# EAGLE design QuadCopterV2 (EAGLE 9.5.2)

## Sheet 1 of 10: Texas EK-TM4C123GXL CONTROLLER BOARD
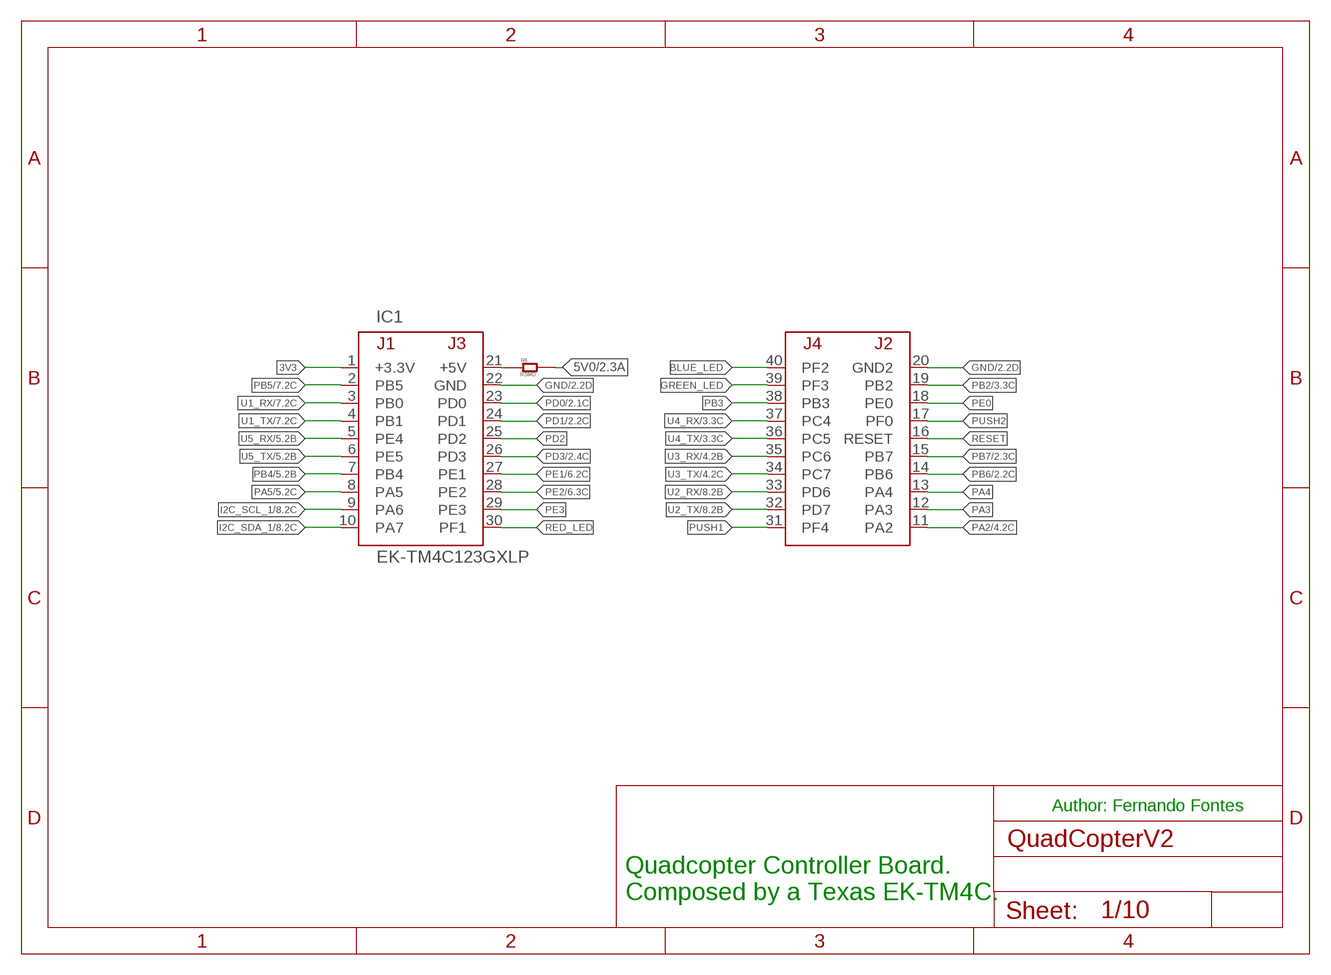
[diagram p0: schematic, sheet 1]

### Parts
IC1  EK-TM4C123GXLP  [TM4C123LAUNCHPAD]
R6  RSMD  [RSMD]

### Nets
3V3: IC1.1(+3.3V)
5V0: R6.2 ; also sheet 2,3,5,6,8,10
BLUE_LED: IC1.40(PF2)
GND: IC1.20(GND2) IC1.22(GND) ; also sheet 2,3,4,5,6,7,8,9,10
GREEN_LED: IC1.39(PF3)
I2C_SCL_1: IC1.9(PA6) ; also sheet 8,9,10
I2C_SDA_1: IC1.10(PA7) ; also sheet 8,9,10
N$1: IC1.21(+5V) R6.1
PA2: IC1.11(PA2) ; also sheet 4
PA3: IC1.12(PA3)
PA4: IC1.13(PA4)
PA5: IC1.8(PA5) ; also sheet 5
PB2: IC1.19(PB2) ; also sheet 3
PB3: IC1.38(PB3)
PB4: IC1.7(PB4) ; also sheet 5
PB5: IC1.2(PB5) ; also sheet 7
PB6: IC1.14(PB6) ; also sheet 2
PB7: IC1.15(PB7) ; also sheet 2
PD0: IC1.23(PD0) ; also sheet 2
PD1: IC1.24(PD1) ; also sheet 2
PD2: IC1.25(PD2)
PD3: IC1.26(PD3) ; also sheet 2
PE0: IC1.18(PE0)
PE1: IC1.27(PE1) ; also sheet 6
PE2: IC1.28(PE2) ; also sheet 6
PE3: IC1.29(PE3)
PUSH1: IC1.31(PF4)
PUSH2: IC1.17(PF0)
RED_LED: IC1.30(PF1)
RESET: IC1.16(RESET)
U1_RX: IC1.3(PB0) ; also sheet 7
U1_TX: IC1.4(PB1) ; also sheet 7
U2_RX: IC1.33(PD6) ; also sheet 8
U2_TX: IC1.32(PD7) ; also sheet 8
U3_RX: IC1.35(PC6) ; also sheet 4
U3_TX: IC1.34(PC7) ; also sheet 4
U4_RX: IC1.37(PC4) ; also sheet 3
U4_TX: IC1.36(PC5) ; also sheet 3
U5_RX: IC1.5(PE4) ; also sheet 5
U5_TX: IC1.6(PE5) ; also sheet 5

### Notes on the sheet
- Author: Fernando Fontes
- Quadcopter Controller Board.
  Composed by a Texas EK-TM4C.

## Sheet 2 of 10: POWER/ESC BOARD
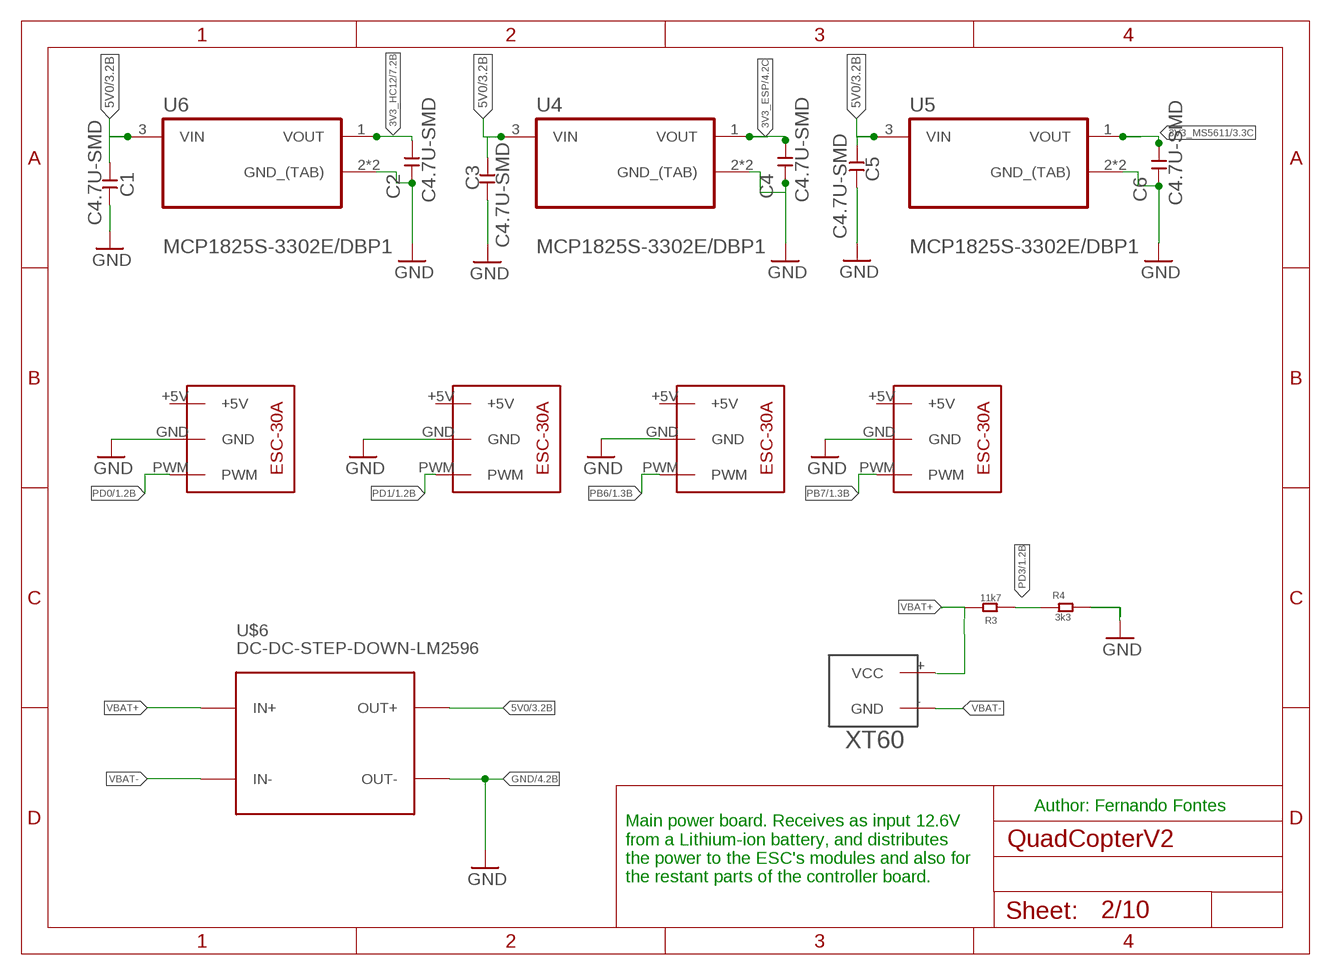
[diagram p1: schematic, sheet 2]

### Parts
C1  C4.7U-SMD  [C4.7U-SMD]
C2  C4.7U-SMD  [C4.7U-SMD]
C3  C4.7U-SMD  [C4.7U-SMD]
C4  C4.7U-SMD  [C4.7U-SMD]
C5  C4.7U-SMD  [C4.7U-SMD]
C6  C4.7U-SMD  [C4.7U-SMD]
R3  11k7  RSMD  [RSMD]
R4  3k3  RSMD  [RSMD]
U4  MCP1825S-3302E/DBP1  [SOT230P700X180-4N#P1]
U5  MCP1825S-3302E/DBP1  [SOT230P700X180-4N#P1]
U6  MCP1825S-3302E/DBP1  [SOT230P700X180-4N#P1]
U7  ESC-30AMS5611  [ESC-30A]
U8  ESC-30AMS5611  [ESC-30A]
U9  ESC-30AMS5611  [ESC-30A]
U10  ESC-30AMS5611  [ESC-30A]
U$6  DC-DC-STEP-DOWN-LM2596  [DC-DC-STEP-DOWN-LM2596]
U$7  XT60  [XT60]

### Nets
3V3_ESP: C4.2 U4.1(VOUT) ; also sheet 4
3V3_HC12: C2.2 U6.1(VOUT) ; also sheet 7
3V3_MS5611: C6.2 U5.1(VOUT) ; also sheet 3,9
5V0: C1.1 C3.2 C5.1 U4.3(VIN) U5.3(VIN) U6.3(VIN) U$6.OUT+ ; also sheet 1,3,5,6,8,10
GND: C1.2 C2.1 C3.1 C4.1 C5.2 C6.1 R4.2 U4.2(GND_(TAB)) U4.4(GND_(TAB)) U5.2(GND_(TAB)) U5.4(GND_(TAB)) U6.2(GND_(TAB)) U6.4(GND_(TAB)) U7.GND U8.GND U9.GND U10.GND U$6.OUT- ; also sheet 1,3,4,5,6,7,8,9,10
PB6: U9.PWM ; also sheet 1
PB7: U10.PWM ; also sheet 1
PD0: U7.PWM ; also sheet 1
PD1: U8.PWM ; also sheet 1
PD3: R3.1 R4.1 ; also sheet 1
VBAT+: R3.2 U$6.IN+ U$7.+(VCC)
VBAT-: U$6.IN- U$7.-(GND)
Unconnected: U7.+5V U8.+5V U9.+5V U10.+5V

### Notes on the sheet
- Author: Fernando Fontes
- Main power board. Receives as input 12.6V
  from a Lithium-ion battery, and distributes
  the power to the ESC's modules and also for
  the restant parts of the controller board.

## Sheet 3 of 10: SIM800L GSM/GPRE MODULE
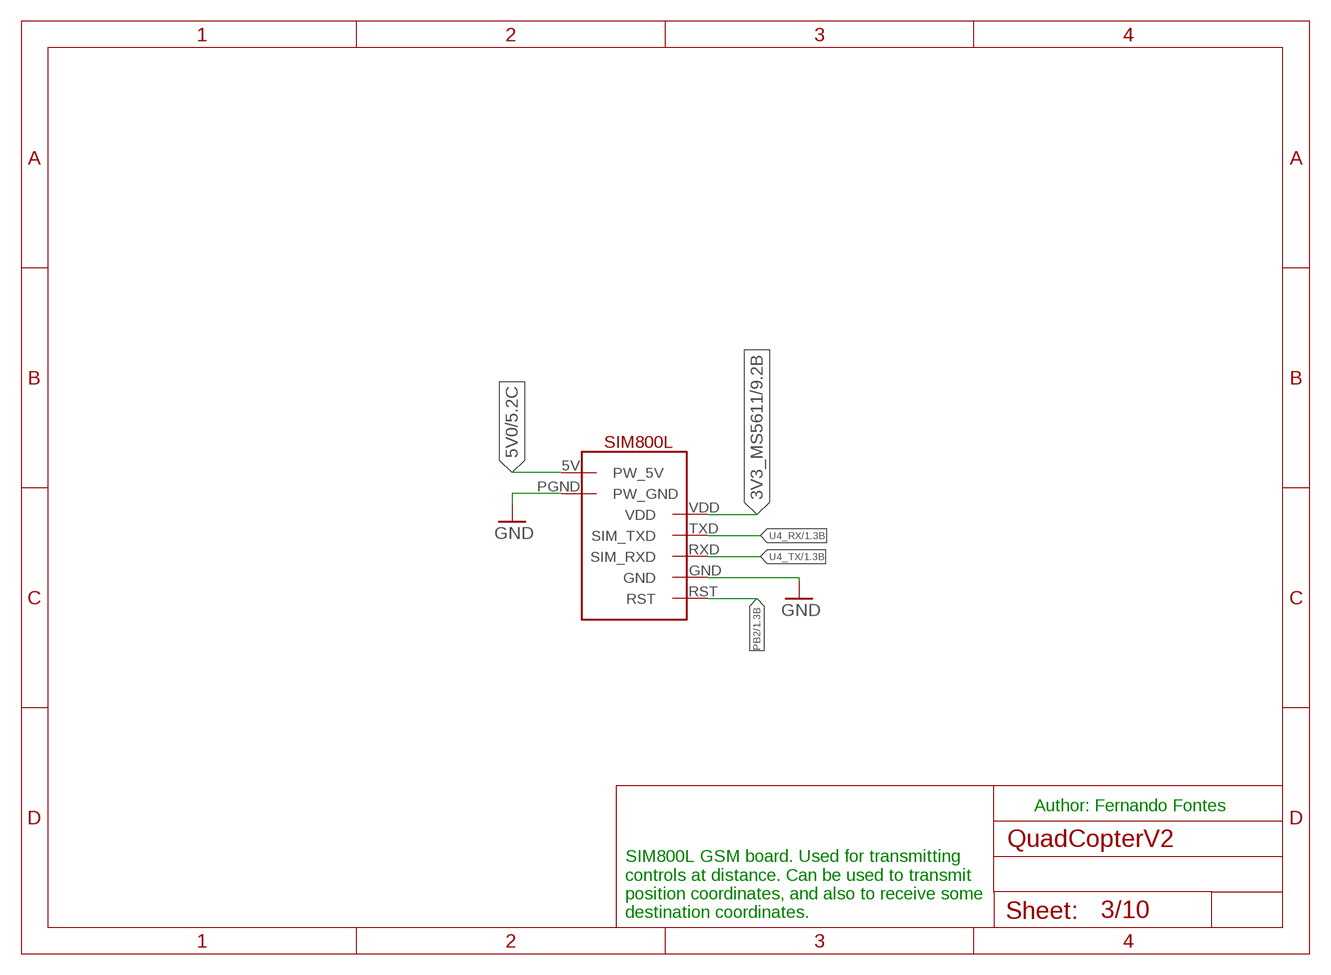
[diagram p2: schematic, sheet 3]

### Parts
U$1  SIM800L  [SIP]

### Nets
3V3_MS5611: U$1.VDD ; also sheet 2,9
5V0: U$1.5V(PW_5V) ; also sheet 1,2,5,6,8,10
GND: U$1.GND U$1.PGND(PW_GND) ; also sheet 1,2,4,5,6,7,8,9,10
PB2: U$1.RST ; also sheet 1
U4_RX: U$1.TXD(SIM_TXD) ; also sheet 1
U4_TX: U$1.RXD(SIM_RXD) ; also sheet 1

### Notes on the sheet
- Author: Fernando Fontes
- SIM800L GSM board. Used for transmitting 
  controls at distance. Can be used to transmit
  position coordinates, and also to receive some
  destination coordinates.

## Sheet 4 of 10: ESP-01 WIFI BOARD
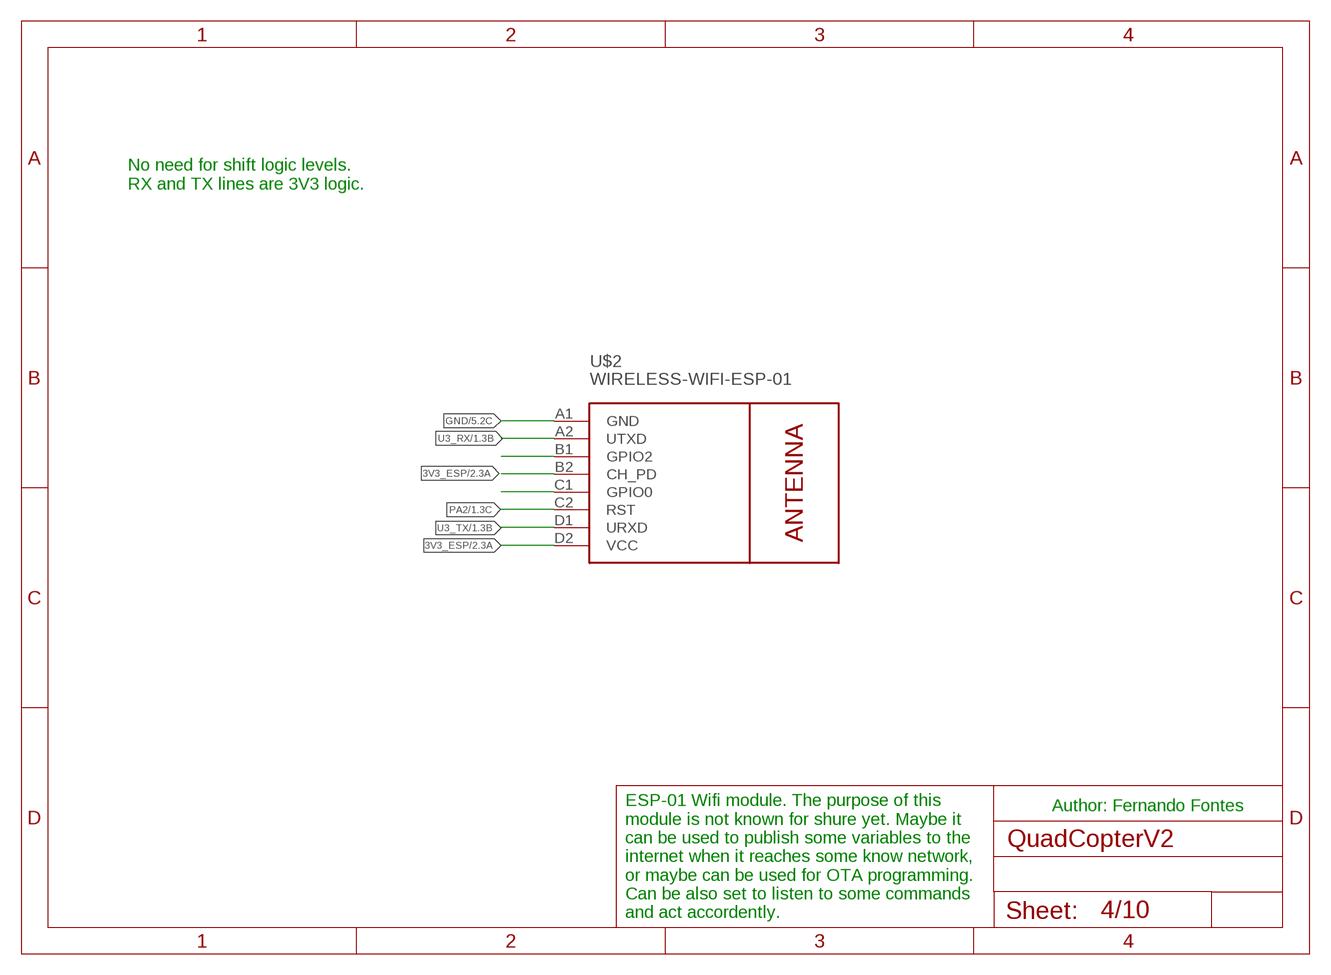
[diagram p3: schematic, sheet 4]

### Parts
U$2  WIRELESS-WIFI-ESP-01  [WIRELESS-WIFI-ESP-01]

### Nets
3V3_ESP: U$2.B2(CH_PD) U$2.D2(VCC) ; also sheet 2
GND: U$2.A1(GND) ; also sheet 1,2,3,5,6,7,8,9,10
N$20: U$2.B1(GPIO2)
N$22: U$2.C1(GPIO0)
PA2: U$2.C2(RST) ; also sheet 1
U3_RX: U$2.A2(UTXD) ; also sheet 1
U3_TX: U$2.D1(URXD) ; also sheet 1

### Notes on the sheet
- No need for shift logic levels. 
  RX and TX lines are 3V3 logic.
- Author: Fernando Fontes
- ESP-01 Wifi module. The purpose of this
  module is not known for shure yet. Maybe it
  can be used to publish some variables to the
  internet when it reaches some know network,
  or maybe can be used for OTA programming.
  Can be also set to listen to some commands
  and act accordently.

## Sheet 5 of 10: HC-05 BLUETOOTH MODULE
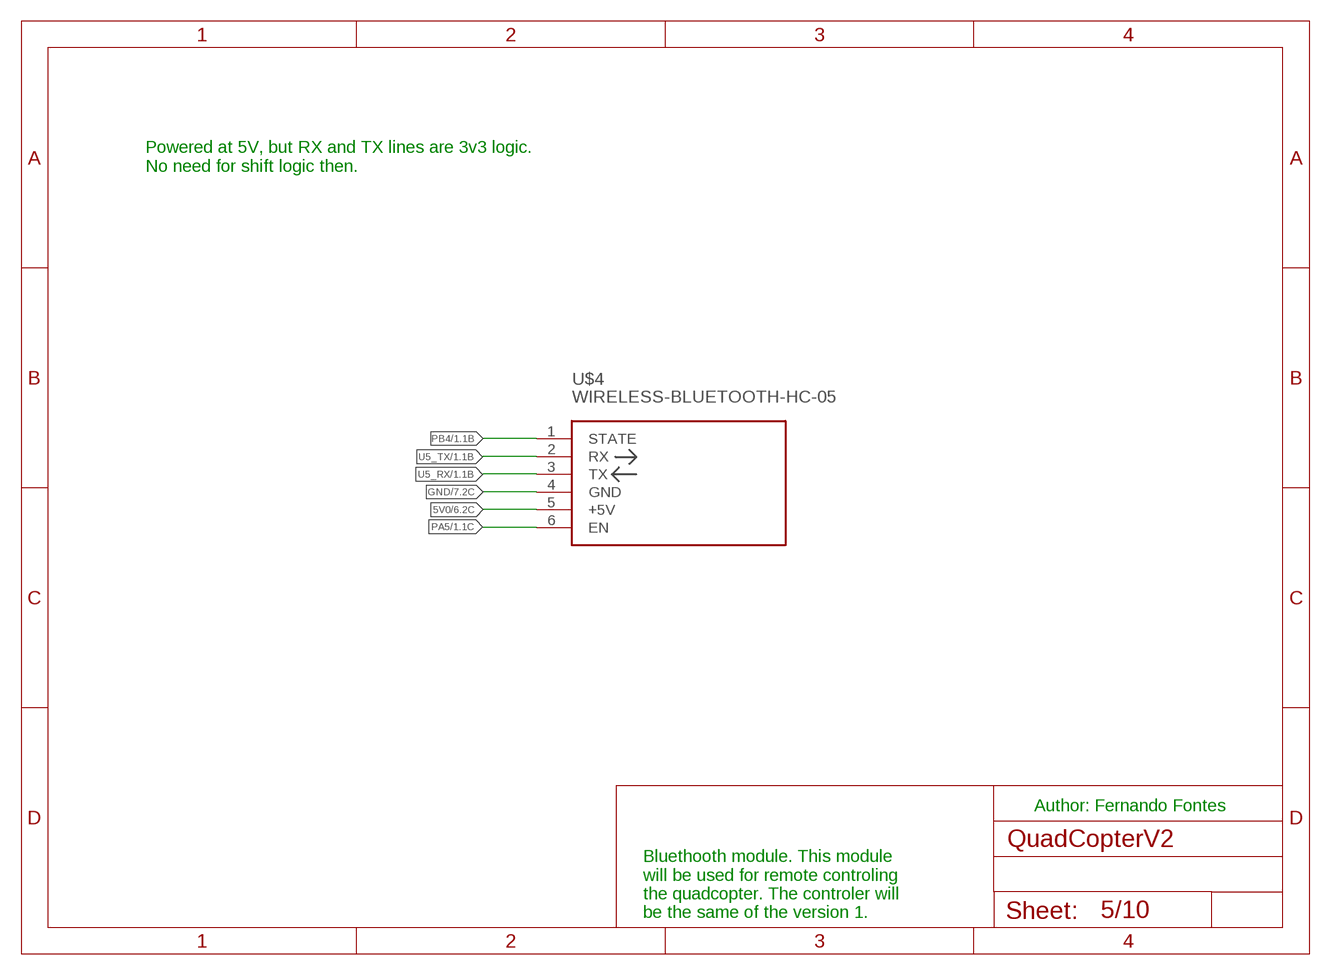
[diagram p4: schematic, sheet 5]

### Parts
U$4  WIRELESS-BLUETOOTH-HC-05  [WIRELESS-BLUETOOTH-HC-05]

### Nets
5V0: U$4.5(+5V) ; also sheet 1,2,3,6,8,10
GND: U$4.4(GND) ; also sheet 1,2,3,4,6,7,8,9,10
PA5: U$4.6(EN) ; also sheet 1
PB4: U$4.1(STATE) ; also sheet 1
U5_RX: U$4.3(TX) ; also sheet 1
U5_TX: U$4.2(RX) ; also sheet 1

### Notes on the sheet
- Powered at 5V, but RX and TX lines are 3v3 logic.
  No need for shift logic then.
- Author: Fernando Fontes
- Bluethooth module. This module
  will be used for remote controling
  the quadcopter. The controler will
  be the same of the version 1.

## Sheet 6 of 10: HC-SR04 ULTRA-SOUND MODULE
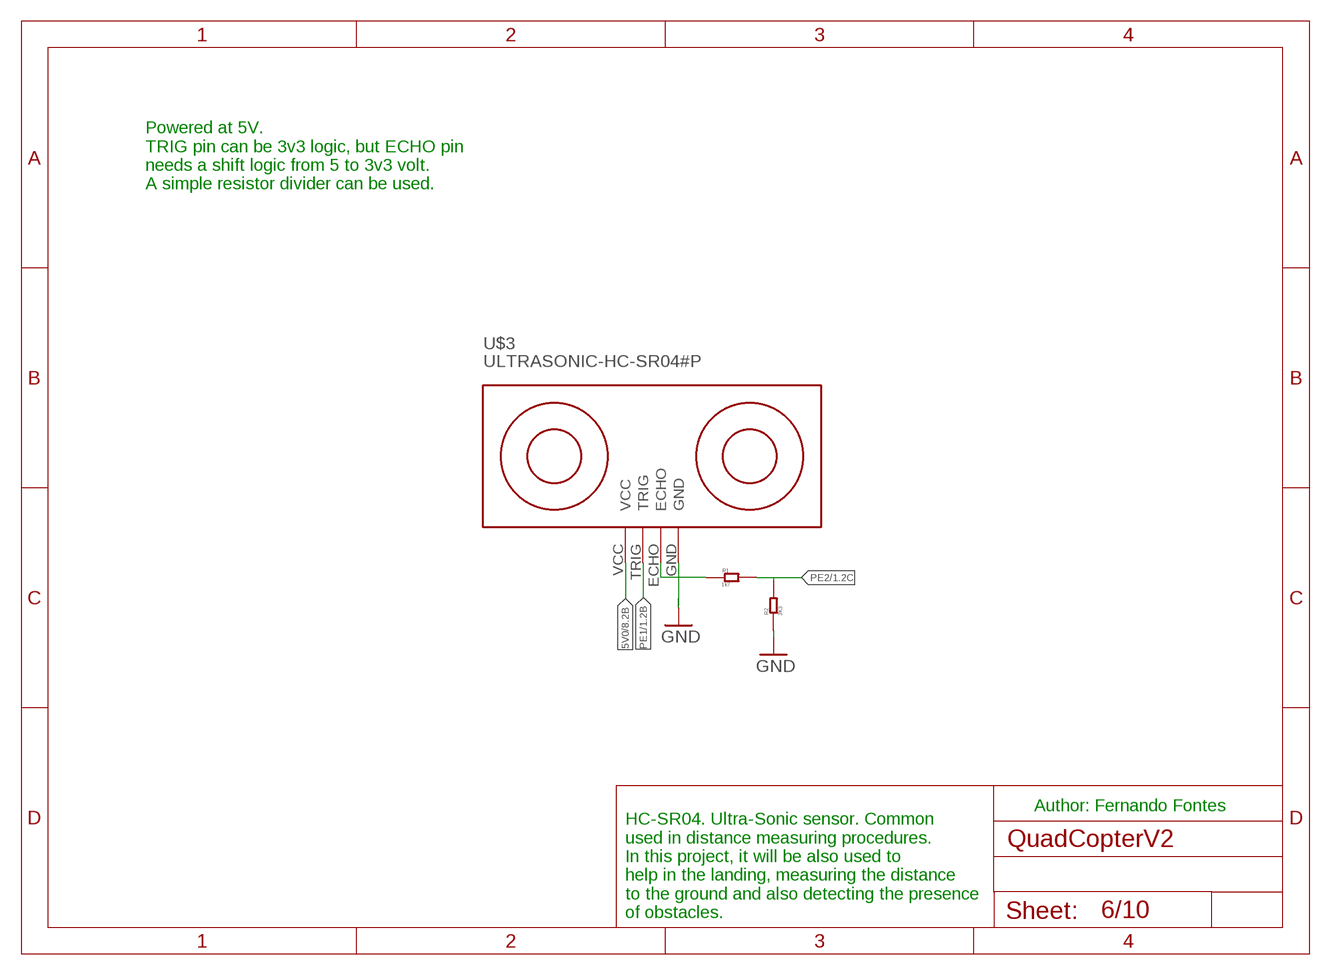
[diagram p5: schematic, sheet 6]

### Parts
R1  1k7  RSMD  [RSMD]
R2  3K3  RSMD  [RSMD]
U$3  ULTRASONIC-HC-SR04#P  [ULTRASONIC-HC-SR04#P]

### Nets
5V0: U$3.VCC ; also sheet 1,2,3,5,8,10
GND: R2.1 U$3.GND ; also sheet 1,2,3,4,5,7,8,9,10
N$34: R1.1 U$3.ECHO
PE1: U$3.TRIG ; also sheet 1
PE2: R1.2 R2.2 ; also sheet 1

### Notes on the sheet
- Powered at 5V.
  TRIG pin can be 3v3 logic, but ECHO pin 
  needs a shift logic from 5 to 3v3 volt.
  A simple resistor divider can be used.
- Author: Fernando Fontes
- HC-SR04. Ultra-Sonic sensor. Common
  used in distance measuring procedures.
  In this project, it will be also used to 
  help in the landing, measuring the distance
  to the ground and also detecting the presence
  of obstacles.

## Sheet 7 of 10: HC-12 RF MODULE
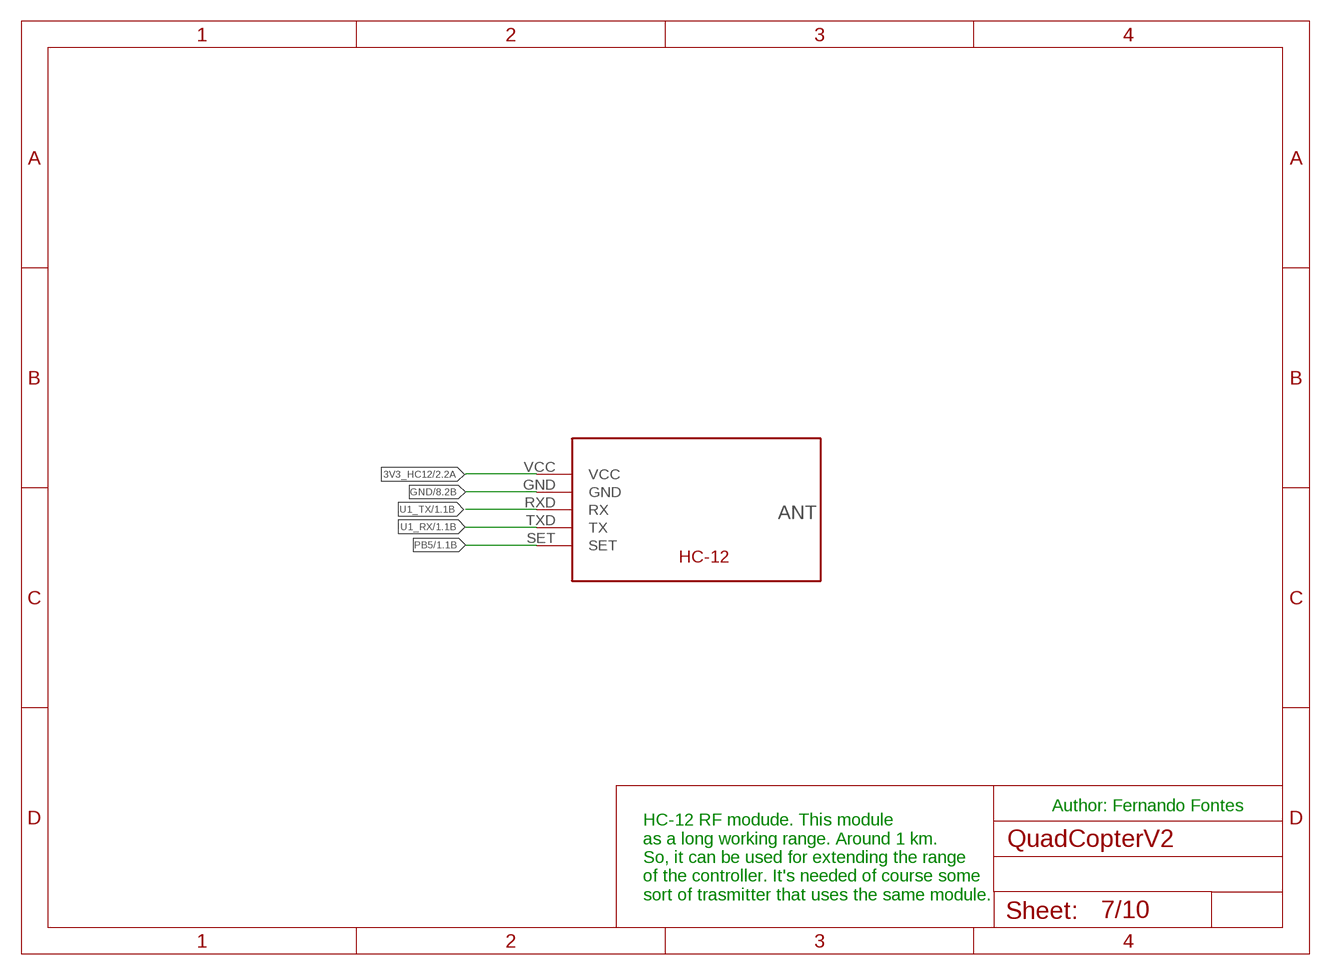
[diagram p6: schematic, sheet 7]

### Parts
U$5  HC-12_FOOTPRINT  [HC-12_FOOTPRINT]

### Nets
3V3_HC12: U$5.VCC ; also sheet 2
GND: U$5.GND ; also sheet 1,2,3,4,5,6,8,9,10
PB5: U$5.SET ; also sheet 1
U1_RX: U$5.TXD(TX) ; also sheet 1
U1_TX: U$5.RXD(RX) ; also sheet 1

### Notes on the sheet
- ANT
- Author: Fernando Fontes
- HC-12 RF modude. This module
  as a long working range. Around 1 km.
  So, it can be used for extending the range
  of the controller. It's needed of course some
  sort of trasmitter that uses the same module.

## Sheet 8 of 10: GPS MODULE
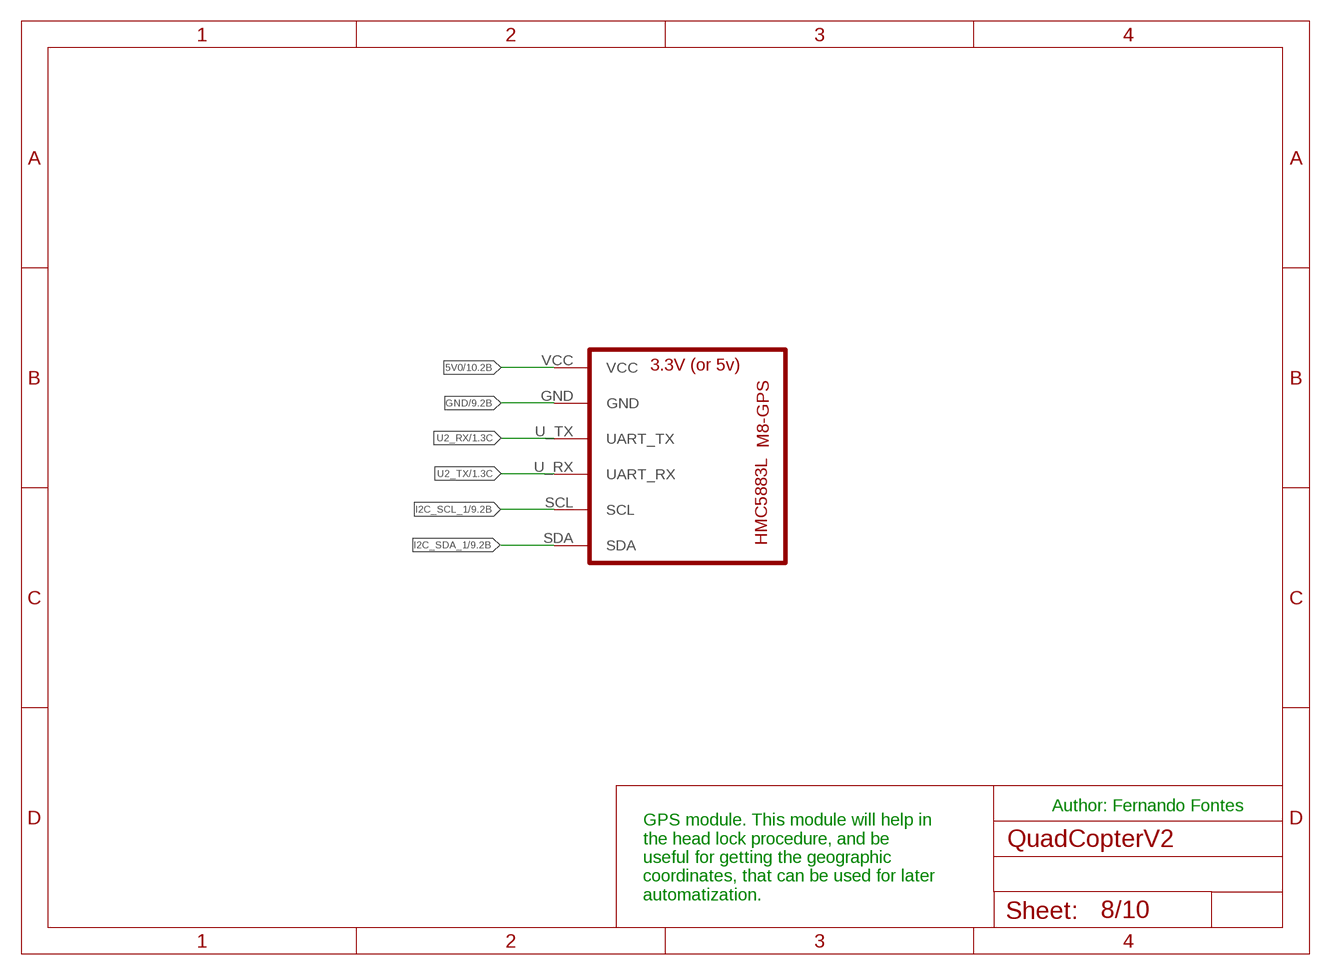
[diagram p7: schematic, sheet 8]

### Parts
U3  GY-63MS5611  [U-BLOX]

### Nets
5V0: U3.VCC ; also sheet 1,2,3,5,6,10
GND: U3.GND ; also sheet 1,2,3,4,5,6,7,9,10
I2C_SCL_1: U3.SCL ; also sheet 1,9,10
I2C_SDA_1: U3.SDA ; also sheet 1,9,10
U2_RX: U3.U_TX(UART_TX) ; also sheet 1
U2_TX: U3.U_RX(UART_RX) ; also sheet 1

### Notes on the sheet
- Author: Fernando Fontes
- GPS module. This module will help in
  the head lock procedure, and be 
  useful for getting the geographic 
  coordinates, that can be used for later
  automatization.

## Sheet 9 of 10: MS5611 BAROMETER BOARD
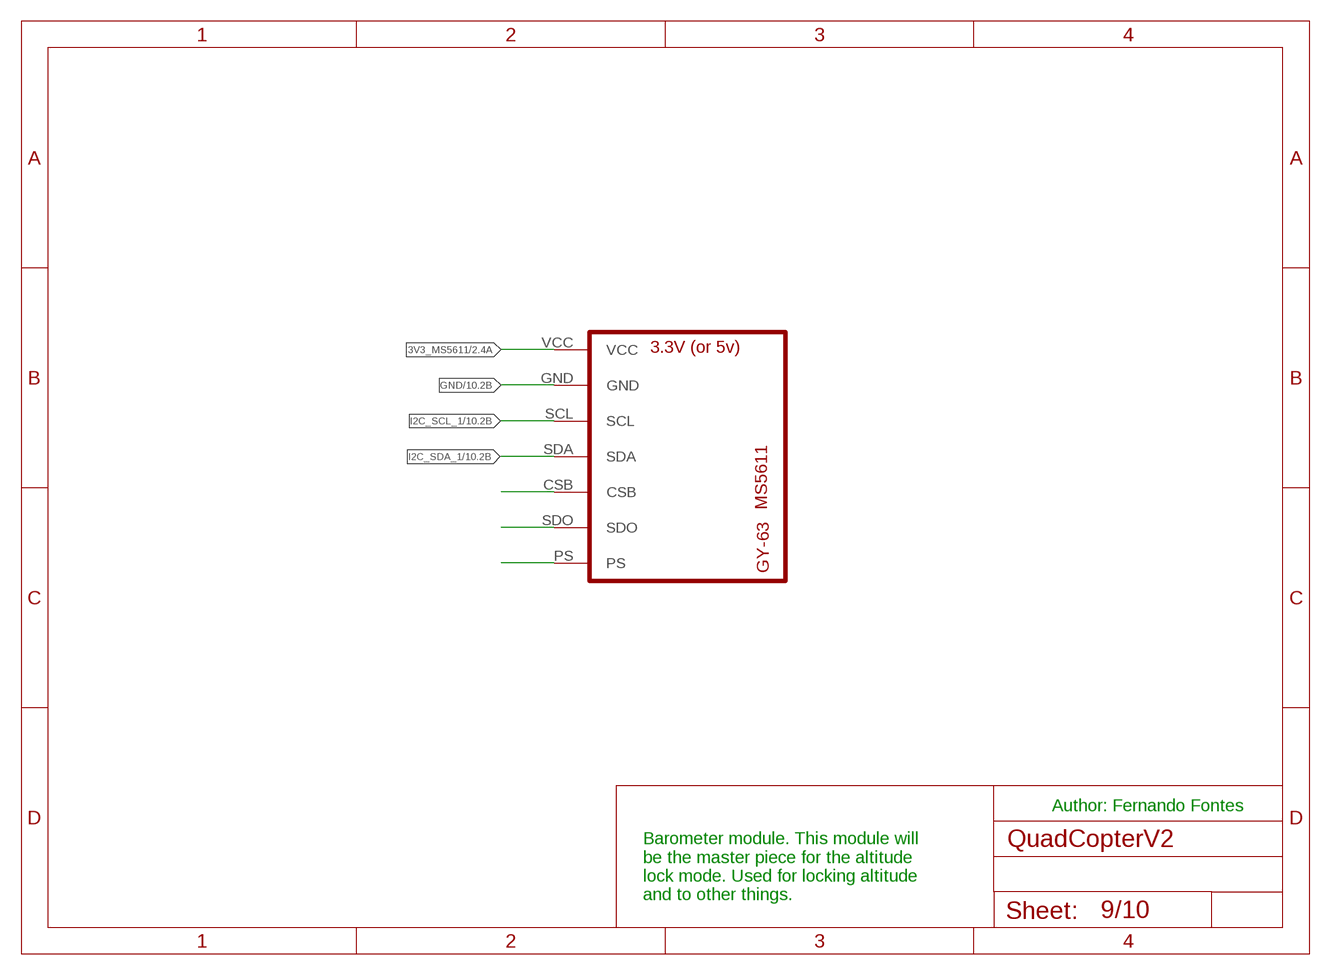
[diagram p8: schematic, sheet 9]

### Parts
U1  GY-63MS5611  [GY-63]

### Nets
3V3_MS5611: U1.VCC ; also sheet 2,3
GND: U1.GND ; also sheet 1,2,3,4,5,6,7,8,10
I2C_SCL_1: U1.SCL ; also sheet 1,8,10
I2C_SDA_1: U1.SDA ; also sheet 1,8,10
N$40: U1.CSB
N$41: U1.SDO
N$42: U1.PS

### Notes on the sheet
- Author: Fernando Fontes
- Barometer module. This module will
  be the master piece for the altitude
  lock mode. Used for locking altitude 
  and to other things.

## Sheet 10 of 10: GY-521 GYROSCOPE MODULE
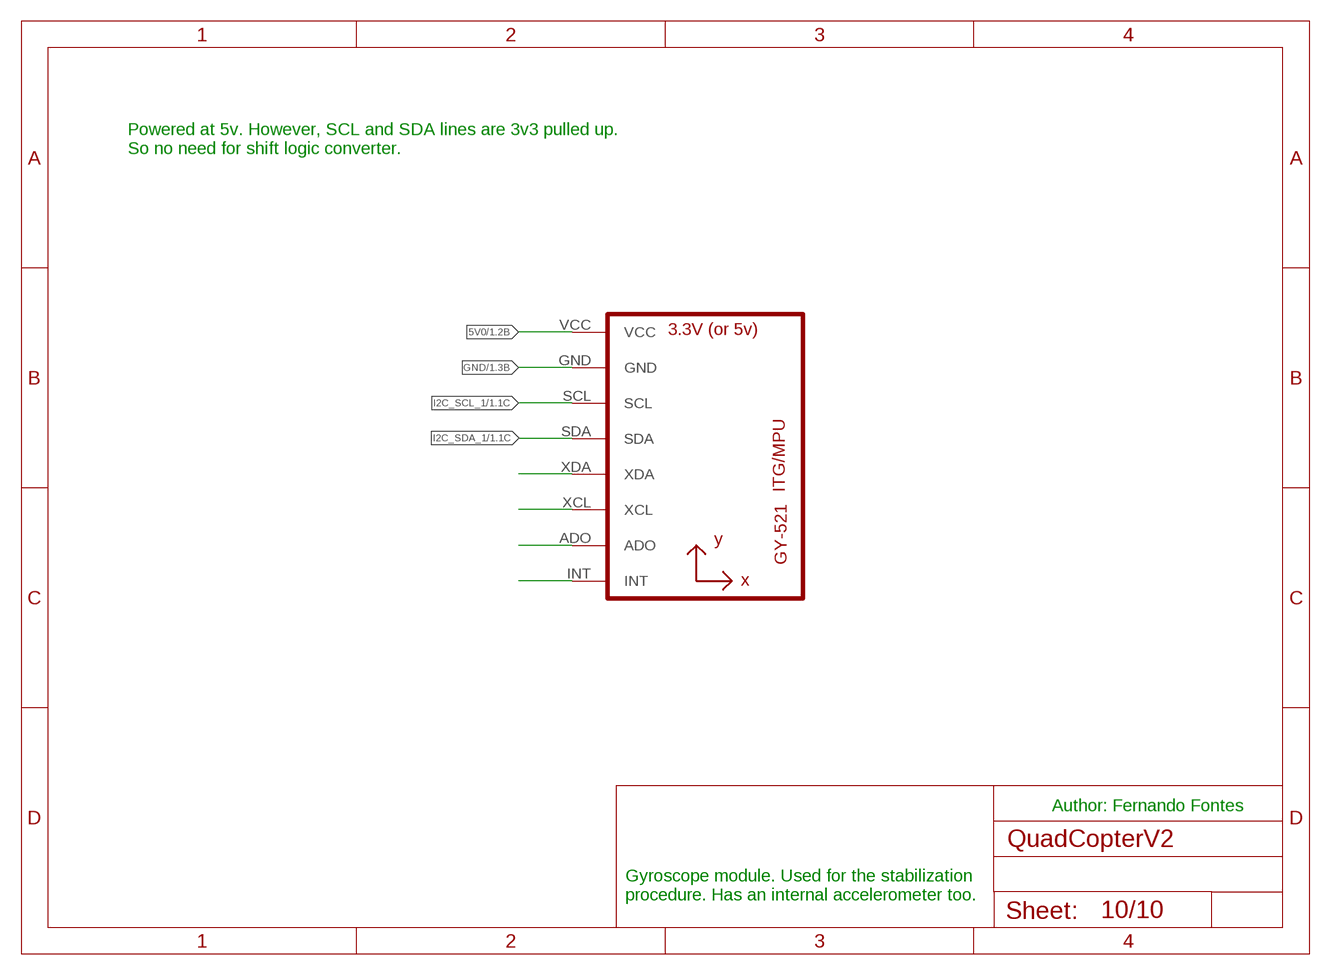
[diagram p9: schematic, sheet 10]

### Parts
U2  GY-521MPU6050  [GY-521]

### Nets
5V0: U2.VCC ; also sheet 1,2,3,5,6,8
GND: U2.GND ; also sheet 1,2,3,4,5,6,7,8,9
I2C_SCL_1: U2.SCL ; also sheet 1,8,9
I2C_SDA_1: U2.SDA ; also sheet 1,8,9
N$45: U2.XDA
N$46: U2.XCL
N$47: U2.ADO
N$48: U2.INT

### Notes on the sheet
- Powered at 5v. However, SCL and SDA lines are 3v3 pulled up. 
  So no need for shift logic converter.
- Author: Fernando Fontes
- Gyroscope module. Used for the stabilization
  procedure. Has an internal accelerometer too.

## Library data of the parts
C1-C6 = smd-rlc:C4.7U-SMD
IC1 = EK-TM4C123GXL:EK-TM4C123GXL: Texas Instruments TM4C123 LaunchPad EK-TM4C123GXL www.ti.com/tool/ek-tm4c123gxl; AVAILABILITY: Unavailable; DESCRIPTION: TM4C123G LaunchPad™ Tiva™ C ARM® Cortex®-M4F MCU 32-Bit Embedded Evaluation Board; MF: Texas Instruments; MP: EK-TM4C123GXL; PACKAGE: None; PRICE: None
R1-R4 R6 = smd-rlc:RSMD; AVAILABILITY: Unavailable; COMMENT: 4-1614884-8; DESCRIPTION: Surface Mount Thin Film Resistor, Cpf Series, 220 Ohm, 100 Mw, - 0.1%, 200 V; MF: TE Connectivity Passive Product; MP: CPF0805B220RE1; PACKAGE: 2012 Stackpole; PRICE: None; TE_PURCHASE_URL: https://www.te.com/usa-en/product-4-1614884-8.html?te_bu=Cor&te_type=disp&te_campaign=seda_glo_cor-seda-global-disp-prtnr-fy19-seda-model-bom-cta_sma-317_1&elqCampaignId=32493
U1 = gy-63:GY-63
U2 = gy-521:GY-521
U3 = u_block_M8:GY-63
U4-U6 = MCP1825S-3302E_DB:MCP1825S-3302E/DB
U7-U10 = ESC-HW30A:ESC-30A
U$1 = SIM800L:SIM800L: SIM800L Blue EVB Board with Level Translation and diode dropper.
U$2 = diy-modules:WIRELESS-WIFI-ESP-01: Wireless Wi-Fi ESP-01 Module based on ESP8266 chip Click here to find device on ebay.com <http://www.ebay.com/sch/esp8266+esp+01+transceiver>
U$3 = diy-modules:ULTRASONIC-HC-SR04: Ultrasonic Ranging Module HC-SR04 More details available here: http://randomnerdtutorials.com/complete-guide-for-ultrasonic-sensor-hc-sr04/ Click here to find device on ebay.com <http://www.ebay.com/sch/hc+sr04+ultrasonic>
U$4 = diy-modules:WIRELESS-BLUETOOTH-HC-05: Bluetooth Transceiver Module based on HC-05 board Tutorial is available here: https://arduino-info.wikispaces.com/BlueTooth-HC05-HC06-Modules-How-To Click here to find device on ebay.com <http://www.ebay.com/sch/hc-05+module+rs232>
U$5 = hc12_433mhz:HC-12_FOOTPRINT: HC-12 433MHz module footprint MCHFIX is for mechanical fix pin which is NC but on this file connected to GND https://github.com/meendiz/hc-12_si4463/
U$6 = diy-modules:DC-DC-STEP-DOWN-LM2596: DC/DC Step-Down Regulator based on LM2596-ADJ chip LM2596 datasheet available here: http://www.ti.com/lit/ds/symlink/lm2596.pdf Click here to find device on ebay.com <http://www.ebay.com/sch/lm2596+power+regulator>
U$7 = XT60:XT60: XT60

## Board
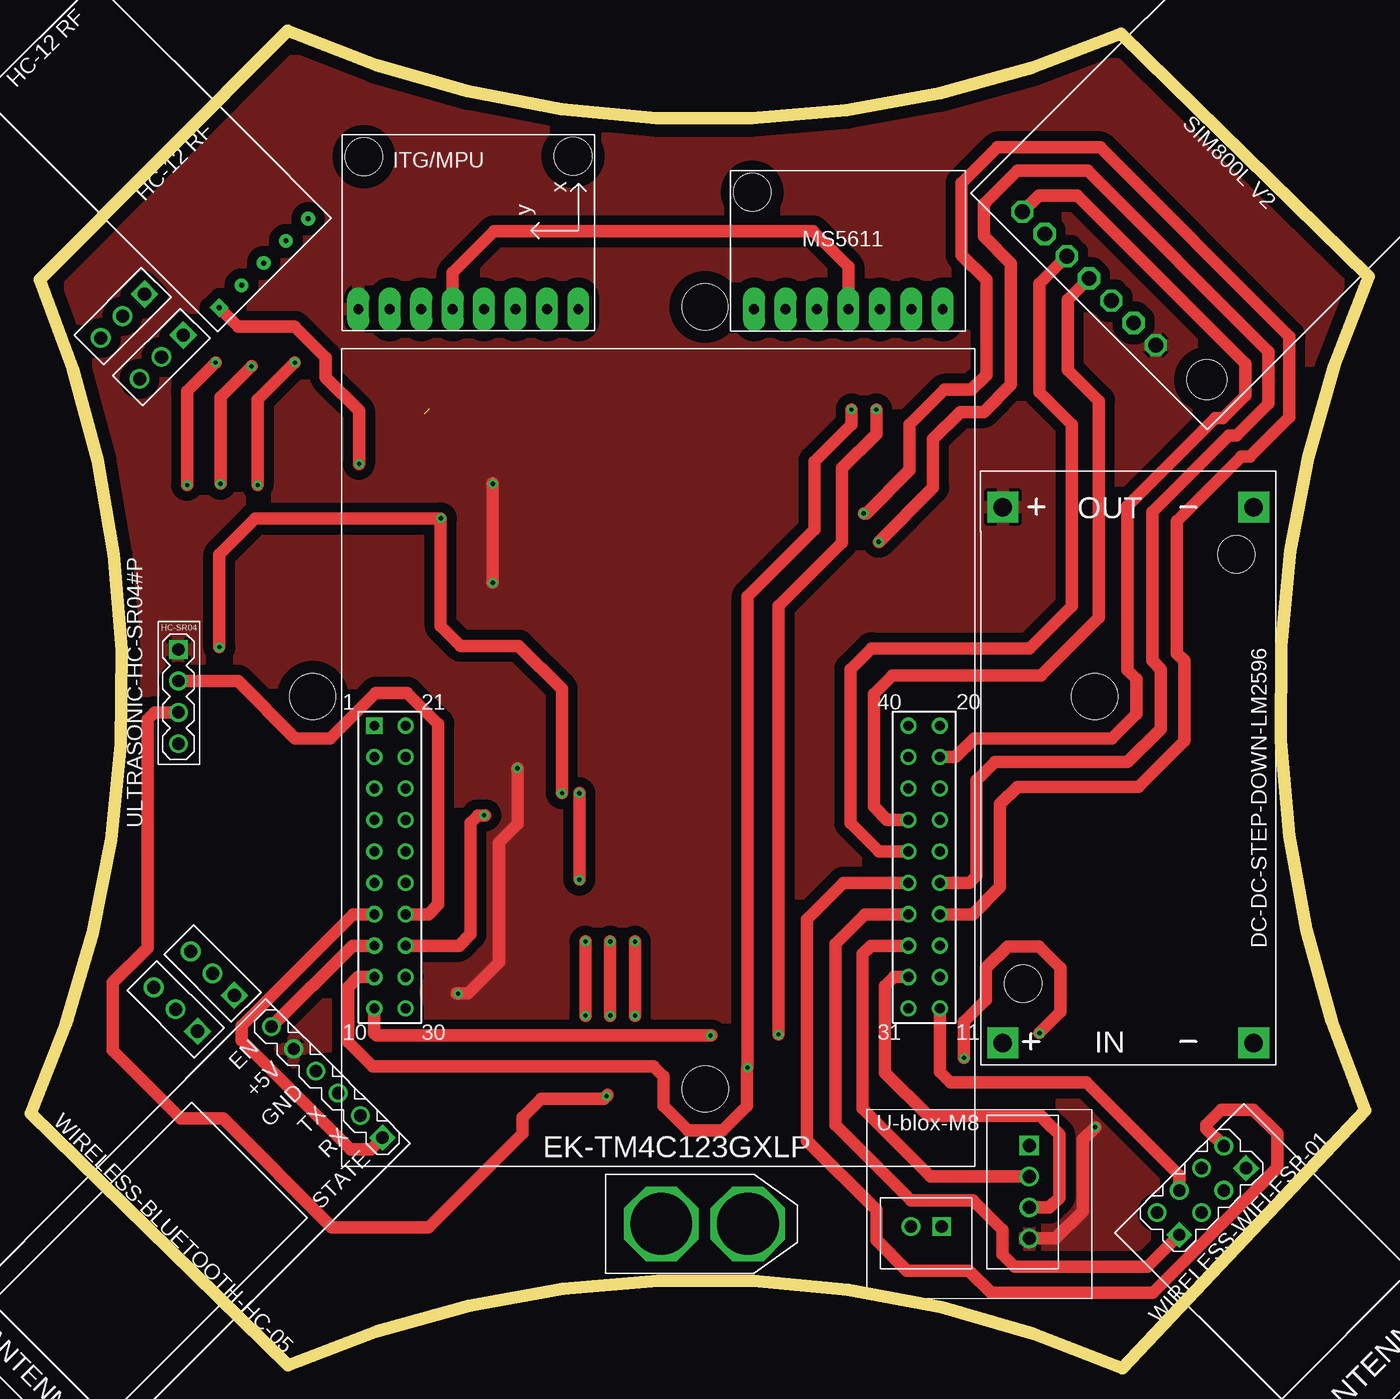
[diagram p10: board, top side]
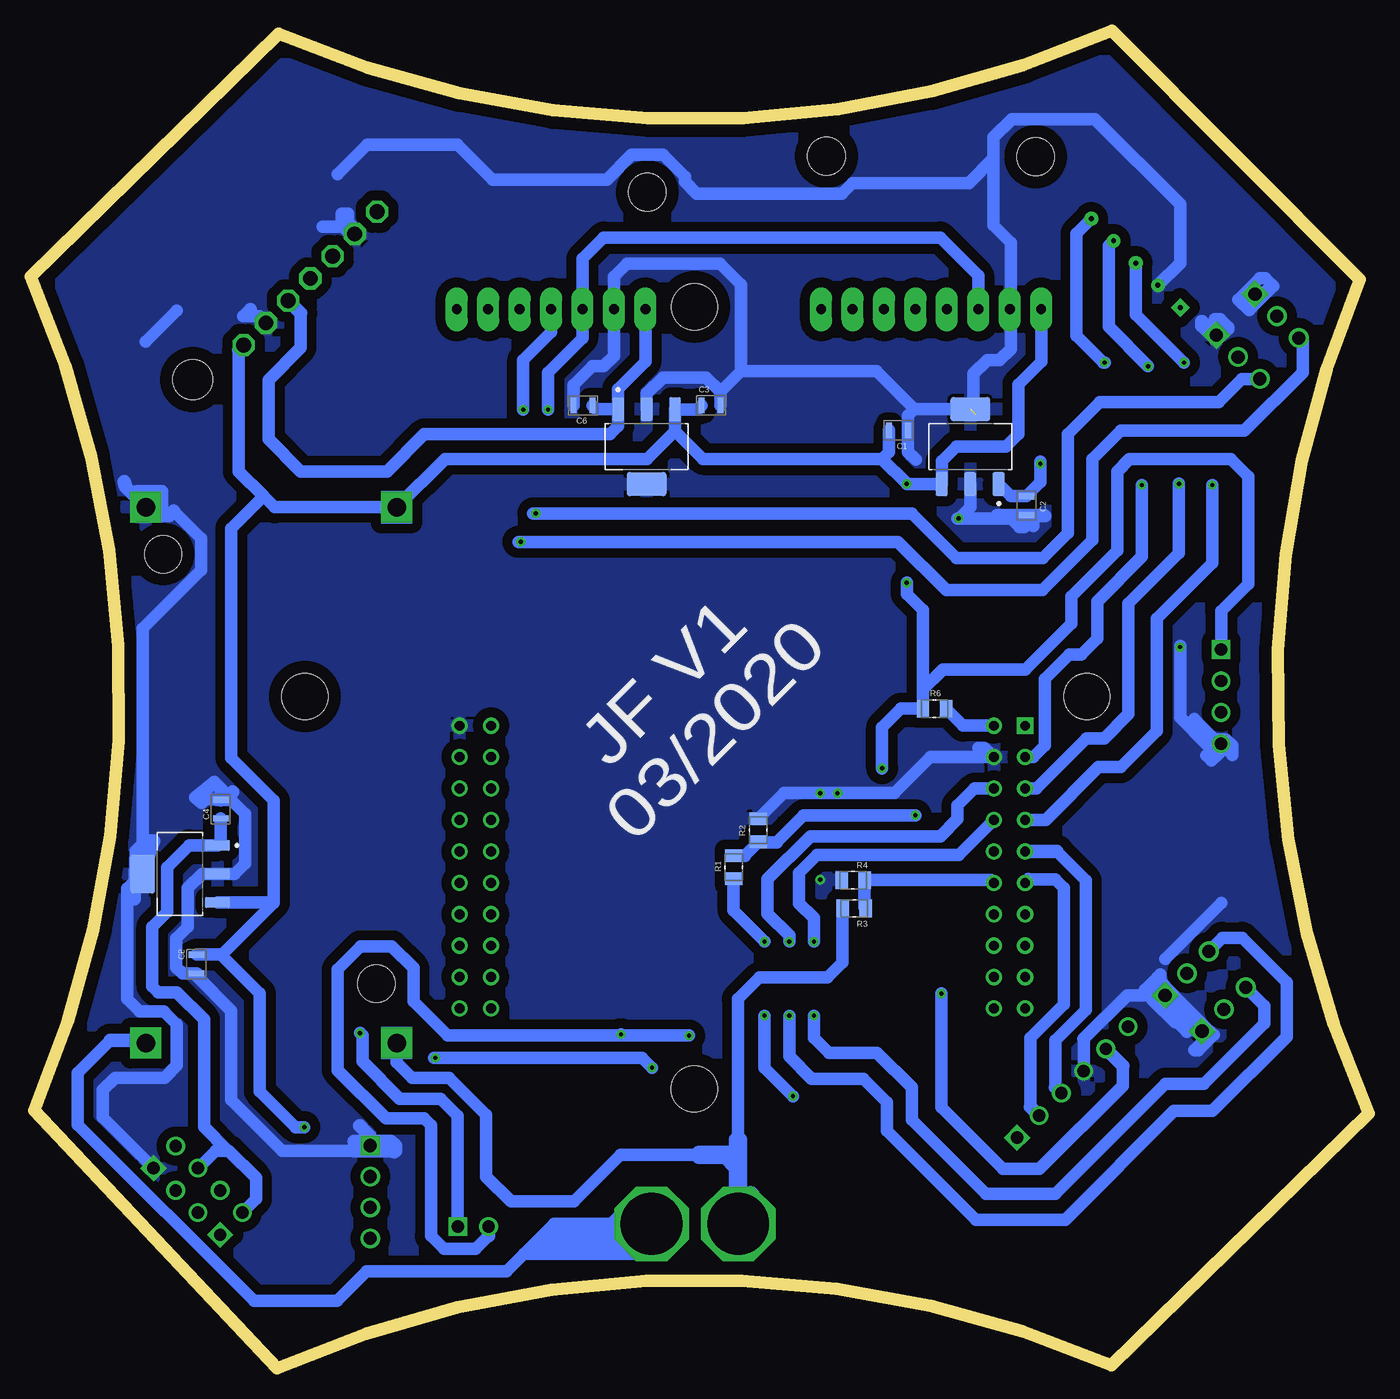
[diagram p11: board, bottom side, seen from below]

Size 108.12 x 108.08 mm. Coordinates in mm from the lower left corner, seen from the top.
Outline: 0,20.6 20.8,0.23 arc-47 88.21,0 107.87,20.83 arc-47 108.12,88.21 88.11,107.85 arc-47 20.75,108.08 0.71,87.99 arc-47 0,20.6
Copper layers (1*16): Top 0.035mm / dielectric 1.5mm / Bottom 0.035mm
Design rules "default": minimum track width 6mil, minimum drill 0.35mm, track to track 6mil, track to pad 6mil, pad to pad 6mil, via to via 6mil, smd to smd 6mil, copper to edge 40mil, drill to drill 6mil, minimum pad ring 10mil, minimum via ring 8mil, stop-mask expansion 4mil, vias tented up to drill 0mil, thermal gap 10mil
Holes 3.72 mm at 54.5,22.57 54.48,85.77 22.77,54.28 85.97,54.28

### Footprints (pad centres in the part's own frame; a part is rotated, then mirrored left to right if it is on the bottom)
C4.7U-SMD = smd 0.5 x 1.25 bottom: 1 -0.935,0; 2 0.59,0
TM4C123LAUNCHPAD = drill 0.8 square: 1 -22.86,12.7 | drill 0.8: 2 -22.86,10.16; 3 -22.86,7.62; 4 -22.86,5.08; 5 -22.86,2.54; 6 -22.86,0; 7 -22.86,-2.54; 8 -22.86,-5.08; 9 -22.86,-7.62; 10 -22.86,-10.16; 11 22.86,-10.16; 12 22.86,-7.62; 13 22.86,-5.08; 14 22.86,-2.54; 15 22.86,0; 16 22.86,2.54; 17 22.86,5.08; 18 22.86,7.62; 19 22.86,10.16; 20 22.86,12.7; 21 -20.32,12.7; 22 -20.32,10.16; 23 -20.32,7.62; 24 -20.32,5.08; 25 -20.32,2.54; 26 -20.32,0; 27 -20.32,-2.54; 28 -20.32,-5.08; 29 -20.32,-7.62; 30 -20.32,-10.16; 31 20.32,-10.16; 32 20.32,-7.62; 33 20.32,-5.08; 34 20.32,-2.54; 35 20.32,0; 36 20.32,2.54; 37 20.32,5.08; 38 20.32,7.62; 39 20.32,10.16; 40 20.32,12.7
RSMD = smd 1 x 1.42 bottom: 1 -0.935,0; 2 0.935,0
GY-63 = drill 0.8 pad 1.778 long: CSB -8.89,-1.27; GND -8.89,6.35; PS -8.89,-6.35; SCL -8.89,3.81; SDA -8.89,1.27; SDO -8.89,-3.81; VCC -8.89,8.89 | hole 3.048: 0.564,9.044
GY-521 = drill 0.8 pad 1.778 long: ADO -8.89,-6.35; GND -8.89,6.35; INT -8.89,-8.89; SCL -8.89,3.81; SDA -8.89,1.27; VCC -8.89,8.89; XCL -8.89,-3.81; XDA -8.89,-1.27 | hole 3.048: 3.444,8.444; 3.482,-8.475
U-BLOX = drill 1.06 square: GND -10.16,-7.62 | drill 1 square: SCL -3.098,-1.07 | drill 1: SDA -0.598,-1.07 | drill 1.06: U_RX -10.16,-2.62; U_TX -10.16,-5.12; VCC -10.16,-0.12
SOT230P700X180-4N#P1 = smd 1.97 x 0.89 bottom: 1 -3.025,2.3; 2 -3.025,0; 3 -3.025,-2.3 | smd 1.97 x 3.19 bottom: 4 3.025,0
ESC-30A = drill 1.06: +5V 0,-3.85; PWM 0,-1.35 | drill 1.06 square: GND 0,-6.35
SIP = drill 1.2 octagon: 5V 38.1,19.24; GND 38.1,6.54; PGND 38.1,16.7; RST 38.1,4; RXD 38.1,9.08; TXD 38.1,11.62; VDD 38.1,14.16 | hole 3.2: 37.16,24.13
WIRELESS-WIFI-ESP-01 = drill 1 square: A1 -8.89,3.81; D1 -8.89,-3.81 | drill 1: A2 -11.43,3.81; B1 -8.89,1.27; B2 -11.43,1.27; C1 -8.89,-1.27; C2 -11.43,-1.27; D2 -11.43,-3.81
ULTRASONIC-HC-SR04#P = drill 1: ECHO 7.42,-1.8; GND 9.96,-1.8; TRIG 4.88,-1.8 | drill 1 square: VCC 2.34,-1.8
WIRELESS-BLUETOOTH-HC-05 = drill 1 square: 1 -6.35,-17.145 | drill 1: 2 -3.81,-17.145; 3 -1.27,-17.145; 4 1.27,-17.145; 5 3.81,-17.145; 6 6.35,-17.145
HC-12_FOOTPRINT = drill 0.4 pad 1.1: GND -1.27,7.62; RXD -1.27,5.08; SET -1.27,0; TXD -1.27,2.54 | drill 0.4 pad 1.1 square: VCC -1.27,10.16
DC-DC-STEP-DOWN-LM2596 = drill 1.5 pad 2.5 square: IN+ -19.812,8.636; IN- -19.812,-11.636; OUT+ 23.5,8.636; OUT- 23.5,-11.636 | hole 3: -14.998,6.98; 19.71,-10.24
XT60 = drill 5 octagon: + 4.5,0; - 11.5,0

### Placement (x,y rotation side)
C1  37.82,75.8 180 top
C2  27.66,69.87 90 top
C3  53.32,77.8 0 top
C4  92.77,45 270 top
C5  94.74,32.48 270 top
C6  63.32,77.8 180 top
IC1  50.62,39.22 0 top
R1  51.32,40.47 90 top
R2  49.32,43.47 270 top
R3  41.57,37.15 0 top
R4  41.66,39.44 0 top
R6  35.08,53.29 0 top
U1  67.35,94.47 90 top
U2  35.36,94.47 90 top
U3  70.53,10.35 180 top
U4  96.07,39.94 0 top
U5  58.35,74.47 270 top
U6  32.2,74.47 90 top
U7  11.96,34.62 45 top
U8  8.97,31.72 45 top
U9  7.82,79 135 top
U10  4.69,82.3 135 top
U$1  104.26,123.23 225 top
U$2  101.81,7.17 315 top
U$3  13.71,60.41 270 top
U$4  11.81,10.98 135 top
U$5  21.51,93.8 135 top
U$6  87.19,46.08 90 top
U$7  46.45,11.65 0 top

### Tracks (layer width: path | path; a pad name or v marks a point on that pad's centre or on a via)
3V3_ESP
  Bottom 1: C4.2 92.77,42.52 U4.1 95.34,42.24 97.1,40.47 97.1,36.88 98.31,35.67 98.31,30.86 97.82,30.37 96.32,30.37 94.12,28.17 94.12,19.49 92.2,17.57 | U$2.D2 89.92,13.67 89.92,15.37 92.12,17.57 92.2,17.57 | U$2.B2 93.2,17.57 92.2,17.57
3V3_HC12  (via drill 0.35)
  Top 1: U$5.VCC 16.77,84.17 21.32,84.17 23.82,81.67 23.82,80.07 26.52,77.37 v26.52,73.07
  Bottom 1: U6.1 28.91,70.46 C2.2 26.52,71.59 v26.52,73.07 26.52,73.27
3V3_MS5611
  Bottom 1: U5.1 62.43,77.5 C6.2 | U1.VCC 58.46,81.34 60.65,79.14 U5.1 | U5.1 60.65,76.14 61.32,75.47 76.32,75.47 79.32,72.47 86.32,72.47 88.92,75.07 88.92,79.87 86.32,82.47 86.32,85.27
  Bottom 1.1: 86.32,85.27 U$1.VDD
5V0  (via drill 0.35)
  Top 1: v37.32,71.47 v37.32,63.47 | v39.32,48.47 39.32,43.97 37.82,42.47 37.82,32.77 35.32,30.27 v34.52,30.27 34.42,30.27 | v86.02,19.47 85.02,18.47 85.02,12.67 82.83,10.47 U3.VCC
  Bottom 1: U2.VCC 26.47,81.33 28.32,79.47 28.32,75.47 29.32,74.47 33.32,74.47 34.5,73.3 U6.3 37.3,71.45 v37.32,71.47 39.32,73.47 | C3.2 54.25,77.47 56.03,77.47 U5.3 56.05,75.74 | 89.32,70.47 88.43,69.58 U$6.OUT+ 74.66,73.47 58.32,73.47 56.05,75.74 | 89.32,70.47 91.32,72.47 91.32,82.29 | 89.32,70.47 91.92,67.87 91.92,49.31 88.48,45.87 88.48,37.64 | 56.05,75.74 53.78,73.47 39.32,73.47 | C1.1 38.76,74.04 39.32,73.47 | 19.87,24.44 19.87,22.8 26.6,16.08 29.55,16.08 34.52,21.06 v34.52,30.27 | U$3.VCC 11.91,61.19 9.72,63.37 9.72,72.07 11.12,73.47 19.32,73.47 20.32,72.47 20.32,66.07 24.02,62.37 24.02,60.17 27.72,56.47 34.42,56.47 36.02,54.88 R6.2 | v39.32,48.47 39.32,51.78 37.82,53.29 R6.2 | R6.2 36.02,61.27 37.32,62.57 v37.32,63.47 | v86.02,19.47 86.72,19.47 89.62,22.37 89.62,30.27 92.77,33.42 C5.1 92.68,33.42 88.48,37.61 88.48,37.64 | 88.48,37.64 U4.3
  Bottom 1.1: 19.87,24.44 U$4.5 | U$1.5V 91.32,82.29
  pour Top (isolate 0.8): 0.42,88.17 5.12,74.17 arc-17 6.82,64.67 arc-3 6.82,49.17 arc-20 2.22,27.17 arc7 0.02,20.47 20.22,0.27 20.32,0.27 arc44 24.32,1.87 33.32,4.37 41.72,6.27 54.42,6.77 67.92,6.37 80.72,2.77 88.32,0.47 107.62,20.47 107.92,21.17 104.32,31.47 102.22,42.27 101.12,52.37 102.02,68.17 107.92,87.57 108.02,88.27 88.22,107.67 78.32,104.67 66.62,101.67 53.22,101.27 38.72,102.77 21.32,107.87 20.52,107.97 0.52,88.17
GND  (via drill 0.35)  (1 unrouted)
  Top 1: v44.32,39.47 v44.32,46.47 | v15.22,58.27 15.22,65.77 18.12,68.67 v33.12,68.67 33.12,59.97 34.72,58.37 39.42,58.37 42.92,54.87 v42.92,46.47
  Bottom 1: 98.83,82.97 96.32,85.47 | 83.32,96.49 80.93,98.88 73.64,98.88 70.82,96.07 61.57,96.07 59.56,98.08 57.04,98.08 55.26,96.3 55.26,95.87 54.3,94.91 42.57,94.91 41.71,95.77 32.32,95.77 30.32,97.77 | U4.4 99.1,59.78 94.37,64.52 94.37,67.06 96.58,69.27 | U$2.A1 102.32,20.26 102.32,22.47 101.32,23.47 97.32,23.47 96.32,24.47 96.32,27.76 97.38,28.82 99.32,28.82 100.35,29.85 100.35,38.75 99.8,39.31 | U7.GND 16.37,30.13 14.56,28.33 | 14.56,28.33 U8.GND 16.85,30.62 16.85,31.8 17.07,31.57 | 11.91,37.6 16.45,33.06 | IC1.22 35.42,49.38 38.32,46.47 v42.92,46.47 v44.32,46.47 47.26,46.47 R2.1 | 89.67,85.02 90.97,85.02 90.4,85.6 90.35,85.6 | 83.02,92.75 83.02,93.32 82.47,93.32 82.47,92.67 81.94,92.14 U$1.GND | 82.55,92.27 83.02,92.75 | 82.55,92.27 84.52,92.27 | 83.02,92.75 83.02,92.32 82.09,91.39 81.66,91.39 | 82.55,92.27 U$1.GND | U$1.GND 81.65,91.67 81.59,91.72 | 31.8,77.1 31.75,77.1 | C2.1 27.59,68.87 26.12,68.87 26.19,68.94 C2.1 | C2.1 27.07,68.36 27.07,68.07 27.66,68.65 30.31,68.65 30.32,68.67 | C2.1 29.17,68.94 28.21,67.97 27.82,67.97 | C2.1 30.06,68.94 30.32,68.67 | IC1.22 31.04,50.12 31.52,50.12 | U7.GND 15.62,29.31 15.62,27.92 17.47,29.77 17.47,30.13 19.51,30.13 23.04,26.6 23.03,26.59 U$4.4 | 14.56,28.33 14.56,27.28 14.67,27.17 18.07,30.57 17.07,31.57 | U7.GND 15.74,30.13 | 15.74,30.13 12.77,27.17 12.77,27.02 14.07,25.72 14.02,25.67 13.77,25.67 12.52,26.92 | 17.07,31.57 17.07,31.47 15.74,30.13 | 12.27,50.37 13.02,50.37 15.22,52.57 v15.22,58.27 15.22,58.37 | 12.27,50.37 12.2,50.45 U$3.GND 11.02,49.57 11.02,50.32 11.52,50.82 12.42,50.82 14.07,52.47 | 12.27,50.37 13.12,49.52 12.7,49.1 12.07,49.72 12.07,50.17 12.27,50.37
  Bottom 1: U10.GND 8.61,86.79 7.82,87.57 | 7.82,87.57 8.35,88.1 8.8,88.1 10.52,86.37 9.65,85.5 7.7,87.45 7.82,87.57 | 12.42,83.6 12.42,84.77 11.97,84.77 11.32,84.12 11.32,83.97 11.81,83.49 U9.GND | 12.42,83.6 U9.GND | 12.42,83.12 12.42,83.6 | U9.GND 13.45,84.62 13.52,84.62 13.52,84.22 12.42,83.12 | U9.GND 12.42,83.12 | U4.2 91.64,39.94 90.79,40.78 90.79,44.77 91.96,45.93 C4.1 | U4.2 94.3,39.94 95.43,38.8 95.43,35.66 96.36,34.73 96.36,32.38 95.87,31.89 94.94,31.89 94.74,31.68 | 92.35,39.94 U4.2 | 99.1,39.13 U4.4 | U4.4 99.1,41.18 | U4.4 99.1,41.24 | IC1.22 30.3,49.49 30.31,49.5 | 30.32,68.67 v33.12,68.67 | v33.12,68.67 33.22,68.67 | U6.2 32.2,69.6 v33.12,68.67 | U$5.GND 15.22,89.31 15.22,94.07 22.11,100.96 28.84,100.96 30.32,99.47 30.32,97.77 | 28.92,85.66 28.92,90.97 30.32,92.37 30.32,97.77 | 28.92,85.66 U2.GND | 36.7,77.5 37.22,76.97 37.22,75.81 C1.2 37.23,74.05 36.6,73.41 | 36.7,77.5 U6.4 31.92,77.77 31.92,80.37 30.82,81.47 29.82,81.47 28.92,82.37 28.92,85.66 | 36.7,77.5 39.77,80.57 50.72,80.57 | 50.72,80.57 52.39,78.91 | 52.39,78.91 C3.1 | U5.2 58.35,78.74 57.02,80.07 53.55,80.07 52.39,78.91 | C6.1 64.26,79.44 62.72,80.97 61.82,80.97 61,81.8 U1.GND 61,88.2 59.92,89.27 52.42,89.27 50.72,87.57 50.72,80.57 | U3.GND 81.09,17.57 82.02,17.57 87.83,17.57 91.92,21.67 91.92,28.87 94.74,31.68 | C5.2 94.74,31.68
  Bottom 1.1: 82.02,17.57 78.86,17.57 78.75,17.47 78.66,17.56 78.66,17.94 79.05,18.33 82,18.33 | U3.GND 80.69,18.71 81.54,19.56 81.53,19.57 81.45,19.49 | U4.4 98.19,42.6 98.81,42.6 99.61,41.8 99.77,37.93 | 91.96,45.93 93.32,47.31 94.79,46.11 | 94.79,46.11 94.33,45.73 | 94.79,46.11 C4.1 91.82,46.58 | U$6.OUT- 98.83,68.9 98.82,68.9 96.94,68.9 96.58,69.27 | U$6.OUT- 99.49,69.58 99.55,69.51 99.55,68.84 98.71,68.84 98.7,68.85 97.58,68.85 97.56,68.87 97.56,70.83 99.53,70.83 99.53,69.46 97.76,69.46 97.73,69.49 97.73,70.03 98.01,70.31 | U$6.OUT- 100.46,71.21 100.57,71.63
  pour Bottom (isolate 0.8): 0.32,87.47 21.32,108.47 28.32,105.47 37.32,102.47 46.32,101.47 52.52,101.07 59.82,101.27 69.42,102.07 77.72,104.07 88.02,107.67 108.12,88.17 105.72,81.77 103.42,73.97 101.42,63.07 101.02,54.37 101.32,46.77 102.32,38.37 106.12,25.37 107.92,20.97 88.32,0.07 82.12,2.37 71.92,5.07 62.92,6.57 51.62,6.87 42.92,6.57 32.32,4.27 20.82,0.47 -0.08,20.37 2.62,27.67 5.12,36.37 6.82,45.37 7.42,54.97 6.62,67.37 4.32,78.17
I2C_SCL_1  (via drill 0.35)
  Top 1: IC1.9 26.45,31.6 25.62,30.77 25.62,26.37 27.62,24.37 50.32,24.37 51.13,23.57 51.13,21.17 53.1,19.2 55.9,19.2 57.88,21.17 57.88,24.23 v57.92,24.27 57.92,62.37 63.32,67.77 63.32,73.27 66.32,76.27 v66.32,77.47 | v75.42,25.07 75.42,27.97 77.2,29.74 77.2,32.33 78.96,34.09 81.46,34.09 83.23,32.33 83.23,28.78 v81.52,27.07
  Bottom 1: v66.32,77.47 66.32,80.47 63.54,83.26 U1.SCL 63.54,89.66 61.82,91.37 34.62,91.37 31.55,88.29 U2.SCL | v57.92,24.27 58.72,25.07 v75.42,25.07 75.52,25.07 | U3.SCL 73.63,20.38 75.02,21.77 78.32,21.77 81.32,24.77 81.32,26.87 v81.52,27.07
I2C_SDA_1  (via drill 0.35)
  Top 1: IC1.10 27.76,27.04 27.92,26.87 v54.92,26.87 55.02,26.87 | v68.32,77.47 68.32,75.47 65.57,72.72 65.57,66.72 60.42,61.57 v60.42,26.97 | U2.SDA 34.09,88.53 37.42,91.87 63.22,91.87 66.08,89.02 U1.SDA
  Bottom 1: 71.13,10.67 72.17,9.62 74.72,9.62 75.78,10.68 75.78,19.63 76.32,20.17 79.42,20.17 83.33,24.08 83.33,32.23 81.46,34.09 78.96,34.09 77.2,32.33 77.2,29.64 74.42,26.87 60.52,26.87 v60.42,26.97 60.32,26.87 v54.92,26.87 | v68.32,77.47 68.32,81.47 66.08,83.72 U1.SDA
  Bottom 1.1: U3.SDA 71.13,10.67
N$1
  Bottom 1: 30.77,51.92 IC1.21 32.78,51.92 R6.1
N$34  (via drill 0.35)
  Top 1: v48.82,28.47 v48.82,34.47 | U$3.ECHO 9.99,52.99 9.42,52.42 9.42,33.97 6.62,31.17 6.62,25.67 12.12,20.17 15.52,20.17 24.32,11.37 32.12,11.37 39.72,18.97 39.72,20.27 41.22,21.77 46.32,21.77 v46.52,21.97 46.62,22.07
  Bottom 1: v48.82,34.47 51.32,36.97 R1.1 | v48.82,28.47 48.82,24.27 v46.52,21.97
PA2
  Top 1: IC1.11 73.48,23.92 74.32,23.07 85.32,23.07 92.83,15.57 U$2.C2
PA5
  Top 1: U$4.6 25.98,34.14 IC1.8
PB2
  Top 1: U$1.RST 81.46,94.77 84.57,94.77 98.16,81.18 98.16,78.6 96.34,76.78 95.72,76.78 88.62,69.68 88.62,56.4 89.35,55.68 89.35,52.88 87.37,50.9 76.26,50.9 74.73,49.38 IC1.19
PB4
  Top 1: U$4.1 27.48,17.67 25.82,17.67 17.02,26.47 17.02,27.67 26.03,36.68 IC1.7
PB5  (via drill 0.35)
  Top 1: v21.32,81.27 18.32,78.27 v18.32,71.37
  Bottom 1: U$5.SET 23.61,91.7 23.61,83.45 21.42,81.27 v21.32,81.27 | IC1.2 27.11,49.38 26.15,50.34 26.15,55.68 24.17,57.66 23.22,57.66 21.92,58.96 21.92,61.97 18.32,65.57 v18.32,71.37
PB6  (via drill 0.35)
  Top 1: v67.32,69.07 67.52,69.07 71.02,72.57 71.02,76.27 73.82,79.07 76.02,79.07 77.22,80.27 77.22,87.97 75.22,89.97 75.22,95.77 78.12,98.67 86.42,98.67 101.72,83.37 101.72,76.87 98.52,73.67 97.82,73.67 92.62,68.47 92.62,57.77 93.22,57.17 93.22,50.67 89.52,46.97 79.72,46.97 78.32,45.57 78.32,38.87 76.13,36.68 IC1.14
  Bottom 1: U9.PWM 10.24,79.95 12.12,78.07 21.72,78.07 24.32,75.47 24.32,67.47 26.32,65.47 33.32,65.47 36.92,69.07 v67.32,69.07 67.52,69.07
PB7  (via drill 0.35)
  Top 1: v68.52,66.77 72.92,71.17 72.92,75.07 75.12,77.27 77.02,77.27 79.22,79.47 79.22,89.27 77.02,91.47 77.02,94.07 79.72,96.77 85.42,96.77 100.02,82.17 100.02,77.97 97.42,75.37 96.82,75.37 90.62,69.17 90.62,57.17 91.32,56.47 91.32,51.67 88.62,48.97 77.92,48.97 76.42,47.47 76.42,39.77 75.87,39.22 IC1.15
  Bottom 1: U10.PWM 5.32,82.94 5.32,80.47 10.02,75.77 20.02,75.77 22.32,73.47 22.32,66.92 26.37,62.87 34.12,62.87 38.02,66.77 v68.52,66.77 68.72,66.77
PD0  (via drill 0.35)
  Top 1: v46.82,28.47 v46.82,34.47
  Bottom 1: v46.82,34.47 46.82,34.97 48.57,36.72 48.57,39.52 45.12,42.97 34.62,42.97 33.22,44.37 33.22,45.47 31.86,46.84 IC1.23 | U7.PWM 11.82,34.76 11.82,34.77 10.22,34.77 6.62,31.17 6.62,26.77 12.62,20.77 15.72,20.77 24.52,11.97 31.72,11.97 38.92,19.17 38.92,21.47 40.82,23.37 45.02,23.37 46.82,25.17 v46.82,28.47
PD1  (via drill 0.35)
  Top 1: v44.82,34.47 v44.82,28.47
  Bottom 1: v44.82,34.47 44.82,36.37 46.02,37.57 46.02,40.02 44.57,41.47 33.12,41.47 IC1.24 | U8.PWM 8.42,29.26 8.42,27.87 13.32,22.97 16.42,22.97 25.32,14.07 30.92,14.07 36.92,20.07 36.92,22.67 39.72,25.47 43.62,25.47 44.82,26.67 v44.82,28.47
PD3
  Bottom 1: IC1.26 30.52,39.44 R4.1 40.73,37.24 R3.1
PE1
  Top 1: IC1.27 32.13,36.68 32.92,37.47 32.92,52.07 30.42,54.57 27.84,54.57 24.17,50.9 21.38,50.9 16.75,55.53 U$3.TRIG
PE2  (via drill 0.35)
  Top 1: IC1.28 34.59,34.14 35.52,35.07 35.52,44.07 36.12,44.67 v36.62,44.67 36.72,44.67
  Bottom 1: v36.62,44.67 45.67,44.67 47.82,42.51 47.82,42.47 49.26,42.47 R2.2 50.42,41.44 50.42,41.37 51.29,41.37 R1.2
U1_RX  (via drill 0.35)
  Top 1: v17.82,80.97 15.32,78.47 v15.32,71.47
  Bottom 1: U$5.TXD 21.01,90.71 21.01,84.16 v17.82,80.97 | v15.32,71.47 15.32,65.87 19.4,61.8 19.4,52.88 21.38,50.9 22.79,50.9 26.86,46.84 IC1.3
U1_TX  (via drill 0.35)
  Top 1: v14.92,81.27 12.62,78.97 v12.62,71.37
  Bottom 1: U$5.RXD 18.81,85.16 v14.92,81.27 | IC1.4 26.1,44.3 21.82,48.57 20.02,48.57 17.12,51.47 17.12,60.57 12.62,65.07 v12.62,71.37
U2_RX
  Top 1: IC1.33 67.89,34.14 67.22,33.47 67.22,20.97 72.72,15.47 U3.U_TX
U2_TX
  Top 1: IC1.32 69.75,31.6 69.02,30.87 69.02,23.87 72.52,20.37 81.62,20.37 82.04,19.96 83.12,18.87 83.12,13.77 82.33,12.97 U3.U_RX
U3_RX
  Top 1: IC1.35 65.67,39.22 62.72,36.27 62.72,18.37 68.32,12.77 68.32,10.37 70.82,7.87 75.82,7.87 77.62,6.07 90.69,6.07 99.29,14.68 100.72,16.2 100.72,18.97 98.82,20.87 96.22,20.87 95.02,19.67 95.02,19.34 U$2.A2
U3_TX
  Top 1: IC1.34 67.43,36.68 65.02,34.27 65.02,19.67 71.12,13.57 76.12,13.57 78.52,11.17 78.52,9.17 79.52,8.17 90.23,8.17 U$2.D1
U4_RX
  Top 1: IC1.37 69.2,44.3 68.12,45.37 68.12,54.47 69.62,55.97 81.62,55.97 86.32,60.67 86.32,78.17 83.82,80.67 83.82,86.36 U$1.TXD
U4_TX
  Top 1: IC1.36 68.54,41.76 66.22,44.07 66.22,56.47 67.92,58.17 80.72,58.17 84.12,61.57 84.12,76.27 81.52,78.87 81.52,87.66 U$1.RXD
U5_RX
  Bottom 1: 25.32,22.7 25.32,26.47 22.85,28.94 22.85,39.4 25.21,41.76
  Bottom 1.1: U$4.3 25.32,22.7 | 25.21,41.76 IC1.5
U5_TX
  Bottom 1: 27.32,21.11 27.32,26.69 24.64,29.38 24.64,38.79 25.32,39.47 27.5,39.47
  Bottom 1.1: 27.32,21.11 U$4.2 | IC1.6 27.5,39.47
VBAT+
  Bottom 1: U$6.IN+ 78.56,24.7 77.32,23.47 74.32,23.47 71.32,20.47 71.32,15.47 69.32,13.47 64.2,13.47 60.45,17.22 54.09,17.22 52.27,17.22 50.95,15.9 | 42.52,36.76 42.51,36.78 R3.2 42.51,32.79 43.72,31.57 49.22,31.57 50.97,29.82 50.97,18.4 50.97,16.93
  Bottom 1.5: 48.68,11.53 U$7.+ | U$7.+ 53.21,11.49 | U$7.+ 50.95,9.44 50.94,9.42 | U$7.+ 50.95,15.9 | U$7.+ 49.94,13.94 51.91,13.9 53.13,12.53 53.06,10.68 51.8,9.53 49.94,9.67 48.72,10.86 48.72,12.46 49.53,13.27 50.24,10.9 51.95,10.94 52.09,12.61 52.13,12.38 52.13,12.35 | U$7.+ 50.97,16.93 51.27,17.22 54.09,17.22 | U$7.+ 50.95,18.38 50.97,18.4
VBAT-
  Bottom 1: 101.72,26.47 104.32,23.87 104.32,19.65 90.1,5.42 83.37,5.42 80.97,7.82 69.67,7.82 68.27,9.22 | U$7.- 59.92,11.65 65.84,11.65 68.27,9.22 | 63.67,9.22 57.92,9.22 | 57.92,9.22 57.17,9.22 55.52,10.87 55.52,11.87 | 63.67,9.22 68.27,9.22 | 55.52,11.87 55.52,12.47 57.12,14.07 57.82,14.07 | 57.82,14.07 58.82,14.07 63.67,9.22 | 57.92,9.22 57.95,9.25 57.95,11.07 65.62,11.07 66.72,9.97 66.62,9.87 59.73,9.87 U$7.- | U$7.- 57.95,13.94 57.82,14.07 | U$7.- 57.73,11.87 55.52,11.87
  Bottom 1.1: 101.72,26.47 99.04,26.47 U$6.IN-
  Bottom 1.5: 65.62,11.07 64.82,10.27 57.12,10.27 56.22,11.17 56.22,12.07 57.22,13.07 58.5,13.07 59.92,11.65 | U$7.- 57.9,11.65 57.32,11.07
(copper drawn outside any net)
  shapes: Bottom area x3

### Text on the board
tNames: SIM800L V2 | HC-12 RF
bNames: JF V1 | 03/2020